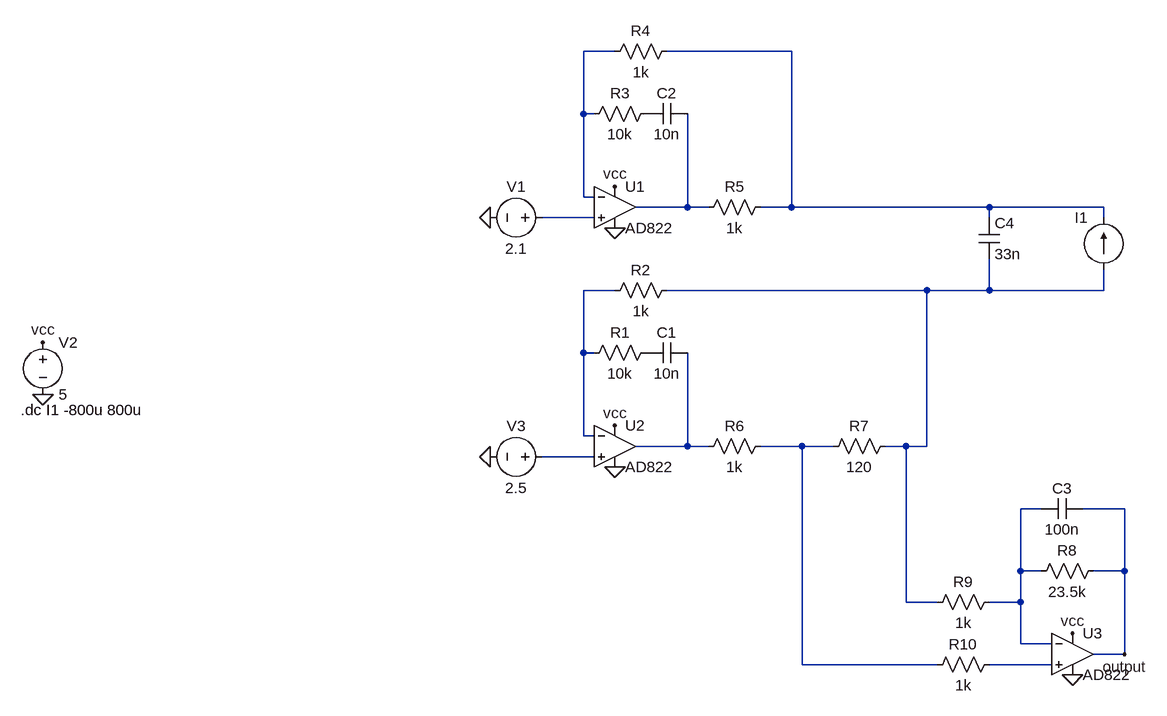
[diagram p0: schematic NissanWbo.asc]
NissanWbo.asc, the LTspice schematic file:
Version 4
SHEET 1 1452 1584
WIRE 512 352 464 352
WIRE 784 352 592 352
WIRE 464 448 464 352
WIRE 480 448 464 448
WIRE 464 576 464 448
WIRE 480 576 464 576
WIRE 624 592 624 448
WIRE 624 592 544 592
WIRE 656 592 624 592
WIRE 784 592 784 352
WIRE 784 592 736 592
WIRE 1088 592 784 592
WIRE 1264 592 1088 592
WIRE 480 608 400 608
WIRE 1088 608 1088 592
WIRE 1264 608 1264 592
WIRE 512 720 464 720
WIRE 992 720 592 720
WIRE 1088 720 1088 672
WIRE 1088 720 992 720
WIRE 1264 720 1264 688
WIRE 1264 720 1088 720
WIRE 464 816 464 720
WIRE 480 816 464 816
WIRE 464 944 464 816
WIRE 480 944 464 944
WIRE 624 960 624 816
WIRE 624 960 544 960
WIRE 656 960 624 960
WIRE 800 960 736 960
WIRE 848 960 800 960
WIRE 960 960 928 960
WIRE 992 960 992 720
WIRE 992 960 960 960
WIRE 480 976 400 976
WIRE 1168 1056 1136 1056
WIRE 1296 1056 1232 1056
WIRE 1136 1152 1136 1056
WIRE 1168 1152 1136 1152
WIRE 1296 1152 1296 1056
WIRE 1296 1152 1248 1152
WIRE 960 1200 960 960
WIRE 1008 1200 960 1200
WIRE 1136 1200 1136 1152
WIRE 1136 1200 1088 1200
WIRE 1136 1264 1136 1200
WIRE 1184 1264 1136 1264
WIRE 1296 1280 1296 1152
WIRE 1296 1280 1248 1280
WIRE 800 1296 800 960
WIRE 1008 1296 800 1296
WIRE 1184 1296 1088 1296
FLAG -368 880 0
FLAG -368 800 vcc
FLAG 512 624 0
FLAG 512 560 vcc
FLAG 320 608 0
FLAG 512 992 0
FLAG 512 928 vcc
FLAG 320 976 0
FLAG 1216 1312 0
FLAG 1216 1248 vcc
FLAG 1296 1280 output
SYMBOL voltage -368 784 R0
WINDOW 123 0 0 Left 0
WINDOW 39 0 0 Left 0
SYMATTR InstName V2
SYMATTR Value 5
SYMBOL Opamps\\AD822 512 528 R0
SYMATTR InstName U1
SYMBOL res 576 432 R90
WINDOW 0 0 56 VBottom 2
WINDOW 3 32 56 VTop 2
SYMATTR InstName R3
SYMATTR Value 10k
SYMBOL res 608 336 R90
WINDOW 0 0 56 VBottom 2
WINDOW 3 32 56 VTop 2
SYMATTR InstName R4
SYMATTR Value 1k
SYMBOL res 752 576 R90
WINDOW 0 0 56 VBottom 2
WINDOW 3 32 56 VTop 2
SYMATTR InstName R5
SYMATTR Value 1k
SYMBOL cap 624 432 R90
WINDOW 0 0 32 VBottom 2
WINDOW 3 32 32 VTop 2
SYMATTR InstName C2
SYMATTR Value 10n
SYMBOL voltage 416 608 R90
WINDOW 0 -32 56 VBottom 2
WINDOW 3 32 56 VTop 2
WINDOW 123 0 0 Left 0
WINDOW 39 0 0 Left 0
SYMATTR InstName V1
SYMATTR Value 2.1
SYMBOL Opamps\\AD822 512 896 R0
SYMATTR InstName U2
SYMBOL res 576 800 R90
WINDOW 0 0 56 VBottom 2
WINDOW 3 32 56 VTop 2
SYMATTR InstName R1
SYMATTR Value 10k
SYMBOL res 608 704 R90
WINDOW 0 0 56 VBottom 2
WINDOW 3 32 56 VTop 2
SYMATTR InstName R2
SYMATTR Value 1k
SYMBOL res 752 944 R90
WINDOW 0 0 56 VBottom 2
WINDOW 3 32 56 VTop 2
SYMATTR InstName R6
SYMATTR Value 1k
SYMBOL cap 624 800 R90
WINDOW 0 0 32 VBottom 2
WINDOW 3 32 32 VTop 2
SYMATTR InstName C1
SYMATTR Value 10n
SYMBOL voltage 416 976 R90
WINDOW 0 -32 56 VBottom 2
WINDOW 3 32 56 VTop 2
WINDOW 123 0 0 Left 0
WINDOW 39 0 0 Left 0
SYMATTR InstName V3
SYMATTR Value 2.5
SYMBOL res 944 944 R90
WINDOW 0 0 56 VBottom 2
WINDOW 3 32 56 VTop 2
SYMATTR InstName R7
SYMATTR Value 120
SYMBOL cap 1072 608 R0
SYMATTR InstName C4
SYMATTR Value 33n
SYMBOL Opamps\\AD822 1216 1216 R0
SYMATTR InstName U3
SYMBOL res 1264 1136 R90
WINDOW 0 0 56 VBottom 2
WINDOW 3 32 56 VTop 2
SYMATTR InstName R8
SYMATTR Value 23.5k
SYMBOL cap 1232 1040 R90
WINDOW 0 0 32 VBottom 2
WINDOW 3 32 32 VTop 2
SYMATTR InstName C3
SYMATTR Value 100n
SYMBOL res 1104 1184 R90
WINDOW 0 0 56 VBottom 2
WINDOW 3 32 56 VTop 2
SYMATTR InstName R9
SYMATTR Value 1k
SYMBOL res 1104 1280 R90
WINDOW 0 0 56 VBottom 2
WINDOW 3 32 56 VTop 2
SYMATTR InstName R10
SYMATTR Value 1k
SYMBOL current 1264 688 R180
WINDOW 0 24 80 Left 2
WINDOW 3 24 52 Invisible 2
WINDOW 39 0 0 Left 0
SYMATTR InstName I1
SYMATTR Value 400µ
SYMATTR Value2 AC 1
TEXT -402 904 Left 2 !.dc I1 -800u 800u

The netlist it stands for:
* NissanWbo.asc
V2 vcc 0 5
XU1 N004 N001 vcc 0 N003 AD822  ; pins In+ In- V+ V- OUT
R3 P001 N001 10k
R4 N002 N001 1k
R5 N002 N003 1k
C2 N003 P001 10n
V1 N004 0 2.1
XU2 N009 N005 vcc 0 N007 AD822  ; pins In+ In- V+ V- OUT
R1 P002 N005 10k
R2 N006 N005 1k
R6 N008 N007 1k
C1 N007 P002 10n
V3 N009 0 2.5
R7 N006 N008 120
C4 N002 N006 33n
XU3 N011 N010 vcc 0 output AD822  ; pins In+ In- V+ V- OUT
R8 output N010 23.5k
C3 output N010 100n
R9 N010 N006 1k
R10 N011 N008 1k
I1 N006 N002 400µ AC 1
.dc I1 -800u 800u
.backanno
.end